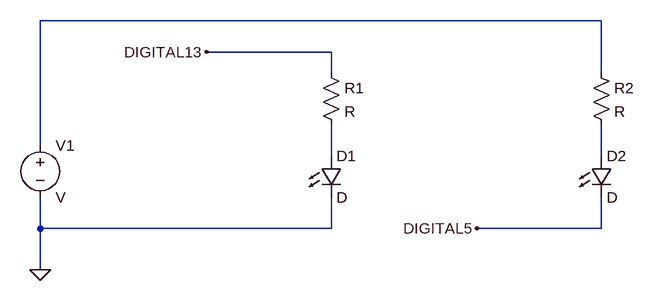
[diagram p0: schematic Led.asc]
Led.asc, the LTspice schematic file:
Version 4
SHEET 1 1004 680
WIRE 944 144 80 144
WIRE 528 192 336 192
WIRE 528 224 528 192
WIRE 944 224 944 144
WIRE 80 336 80 144
WIRE 528 352 528 304
WIRE 944 352 944 304
WIRE 80 464 80 416
WIRE 528 464 528 416
WIRE 528 464 80 464
WIRE 944 464 944 416
WIRE 944 464 752 464
WIRE 80 528 80 464
FLAG 336 192 DIGITAL13
FLAG 80 528 0
FLAG 752 464 DIGITAL5
SYMBOL voltage 80 320 R0
SYMATTR InstName V1
SYMBOL res 512 208 R0
SYMATTR InstName R1
SYMBOL LED 512 352 R0
SYMATTR InstName D1
SYMBOL LED 928 352 R0
SYMATTR InstName D2
SYMBOL res 928 208 R0
SYMATTR InstName R2

The netlist it stands for:
* Led.asc
V1 N001 0 V
R1 DIGITAL13 N002 R
D1 N002 0 D
D2 N003 DIGITAL5 D
R2 N001 N003 R
.model D D
.lib standard.dio
.backanno
.end